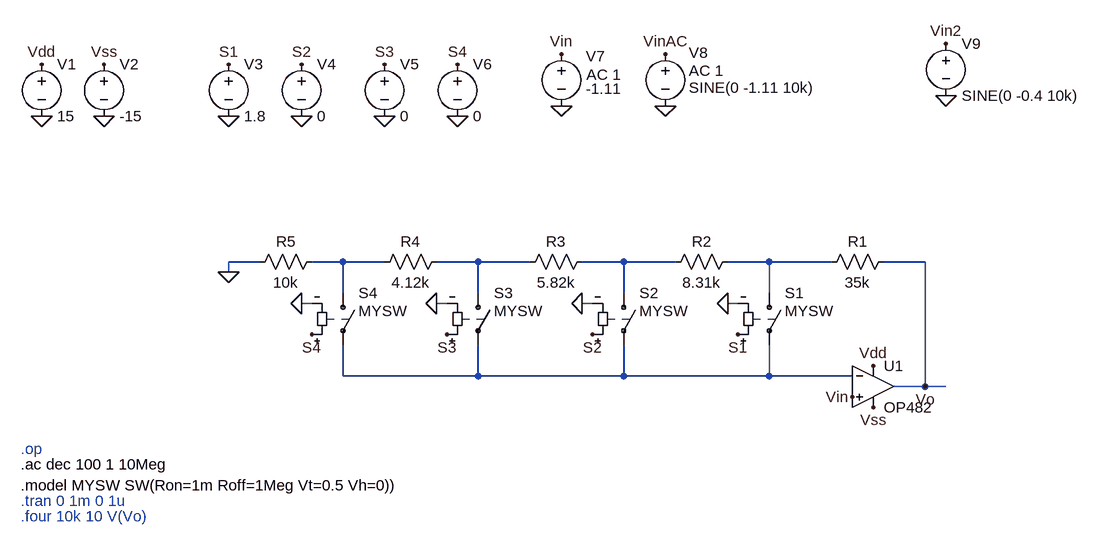
[diagram p0: schematic Etaj3.asc]
Etaj3.asc, the LTspice schematic file:
Version 4
SHEET 1 1120 680
WIRE -160 176 -208 176
WIRE -32 176 -80 176
WIRE 32 176 -32 176
WIRE 176 176 112 176
WIRE 256 176 176 176
WIRE 400 176 336 176
WIRE 480 176 400 176
WIRE 624 176 560 176
WIRE 720 176 624 176
WIRE 864 176 800 176
WIRE -208 192 -208 176
WIRE -32 224 -32 176
WIRE 176 224 176 176
WIRE 400 224 400 176
WIRE 624 224 624 176
WIRE -80 240 -96 240
WIRE 128 240 112 240
WIRE 352 240 336 240
WIRE 576 240 560 240
WIRE -32 352 -32 304
WIRE 176 352 176 304
WIRE 176 352 -32 352
WIRE 400 352 400 304
WIRE 400 352 176 352
WIRE 624 352 624 304
WIRE 624 352 400 352
WIRE 752 352 624 352
WIRE 864 368 864 176
WIRE 864 368 816 368
WIRE 896 368 864 368
FLAG 752 384 Vin
FLAG -496 -48 0
FLAG -400 -48 0
FLAG -496 -128 Vdd
FLAG 784 336 Vdd
FLAG -400 -128 Vss
FLAG 784 400 Vss
FLAG -96 240 0
FLAG 112 240 0
FLAG 336 240 0
FLAG 560 240 0
FLAG -208 -48 0
FLAG -96 -48 0
FLAG 32 -48 0
FLAG 144 -48 0
FLAG -208 -128 S1
FLAG -96 -128 S2
FLAG 32 -128 S3
FLAG 144 -128 S4
FLAG 576 288 S1
FLAG 352 288 S2
FLAG 128 288 S3
FLAG -80 288 S4
FLAG -208 192 0
FLAG 304 -64 0
FLAG 304 -144 Vin
FLAG 464 -144 VinAC
FLAG 464 -64 0
FLAG 864 368 Vo
FLAG 896 -80 0
FLAG 896 -160 Vin2
SYMBOL OpAmps\\OP482 784 304 R0
SYMATTR InstName U1
SYMBOL voltage -496 -144 R0
WINDOW 123 0 0 Left 0
WINDOW 39 0 0 Left 0
SYMATTR InstName V1
SYMATTR Value 15
SYMBOL voltage -400 -144 R0
WINDOW 123 0 0 Left 0
WINDOW 39 0 0 Left 0
SYMATTR InstName V2
SYMATTR Value -15
SYMBOL sw 624 208 R0
WINDOW 3 24 44 Left 2
SYMATTR Value MYSW
SYMATTR InstName S1
SYMBOL sw 400 208 R0
WINDOW 3 24 44 Left 2
SYMATTR Value MYSW
SYMATTR InstName S2
SYMBOL sw 176 208 R0
WINDOW 3 24 44 Left 2
SYMATTR Value MYSW
SYMATTR InstName S3
SYMBOL sw -32 208 R0
WINDOW 3 24 44 Left 2
SYMATTR Value MYSW
SYMATTR InstName S4
SYMBOL res 816 160 R90
WINDOW 0 0 56 VBottom 2
WINDOW 3 32 56 VTop 2
SYMATTR InstName R1
SYMATTR Value 35k
SYMBOL res 576 160 R90
WINDOW 0 0 56 VBottom 2
WINDOW 3 32 56 VTop 2
SYMATTR InstName R2
SYMATTR Value 8.31k
SYMBOL res 352 160 R90
WINDOW 0 0 56 VBottom 2
WINDOW 3 32 56 VTop 2
SYMATTR InstName R3
SYMATTR Value 5.82k
SYMBOL res 128 160 R90
WINDOW 0 0 56 VBottom 2
WINDOW 3 32 56 VTop 2
SYMATTR InstName R4
SYMATTR Value 4.12k
SYMBOL res -64 160 R90
WINDOW 0 0 56 VBottom 2
WINDOW 3 32 56 VTop 2
SYMATTR InstName R5
SYMATTR Value 10k
SYMBOL voltage -208 -144 R0
WINDOW 123 0 0 Left 0
WINDOW 39 0 0 Left 0
SYMATTR InstName V3
SYMATTR Value 1.8
SYMBOL voltage -96 -144 R0
WINDOW 123 0 0 Left 0
WINDOW 39 0 0 Left 0
SYMATTR InstName V4
SYMATTR Value 0
SYMBOL voltage 32 -144 R0
WINDOW 123 0 0 Left 0
WINDOW 39 0 0 Left 0
SYMATTR InstName V5
SYMATTR Value 0
SYMBOL voltage 144 -144 R0
WINDOW 123 0 0 Left 0
WINDOW 39 0 0 Left 0
SYMATTR InstName V6
SYMATTR Value 0
SYMBOL voltage 304 -160 R0
WINDOW 0 38 19 Left 2
WINDOW 3 38 69 Left 2
WINDOW 123 39 48 Left 2
WINDOW 39 0 0 Left 0
SYMATTR InstName V7
SYMATTR Value -1.11
SYMATTR Value2 AC 1
SYMBOL voltage 464 -160 R0
WINDOW 0 36 14 Left 2
WINDOW 3 36 68 Left 2
WINDOW 123 36 42 Left 2
WINDOW 39 0 0 Left 0
SYMATTR InstName V8
SYMATTR Value SINE(0 -1.11 10k)
SYMATTR Value2 AC 1
SYMBOL voltage 896 -176 R0
WINDOW 123 0 0 Left 0
WINDOW 39 0 0 Left 0
SYMATTR InstName V9
SYMATTR Value SINE(0 -0.4 10k)
TEXT -528 488 Left 2 !.ac dec 100 1 10Meg
TEXT -528 520 Left 2 !.model MYSW SW(Ron=1m Roff=1Meg Vt=0.5 Vh=0))
TEXT -528 464 Left 2 ;.op
TEXT -528 544 Left 2 ;.tran 0 1m 0 1u
TEXT -528 568 Left 2 ;.four 10k 10 V(Vo)

The netlist it stands for:
* Etaj3.asc
XU1 Vin N005 Vdd Vss Vo OP482  ; pins In+ In- V+ V- OUT
V1 Vdd 0 15
V2 Vss 0 -15
S1 N004 N005 S1 0 MYSW
S2 N003 N005 S2 0 MYSW
S3 N002 N005 S3 0 MYSW
S4 N001 N005 S4 0 MYSW
R1 Vo N004 35k
R2 N004 N003 8.31k
R3 N003 N002 5.82k
R4 N002 N001 4.12k
R5 N001 0 10k
V3 S1 0 1.8
V4 S2 0 0
V5 S3 0 0
V6 S4 0 0
V7 Vin 0 -1.11 AC 1
V8 VinAC 0 SINE(0 -1.11 10k) AC 1
V9 Vin2 0 SINE(0 -0.4 10k)
.ac dec 100 1 10Meg
.model MYSW SW(Ron=1m Roff=1Meg Vt=0.5 Vh=0))
* .op
* .tran 0 1m 0 1u
* .four 10k 10 V(Vo)
.backanno
.end